# EAGLE design DMGC-IPS-01_1-3 (EAGLE 9.6.2)
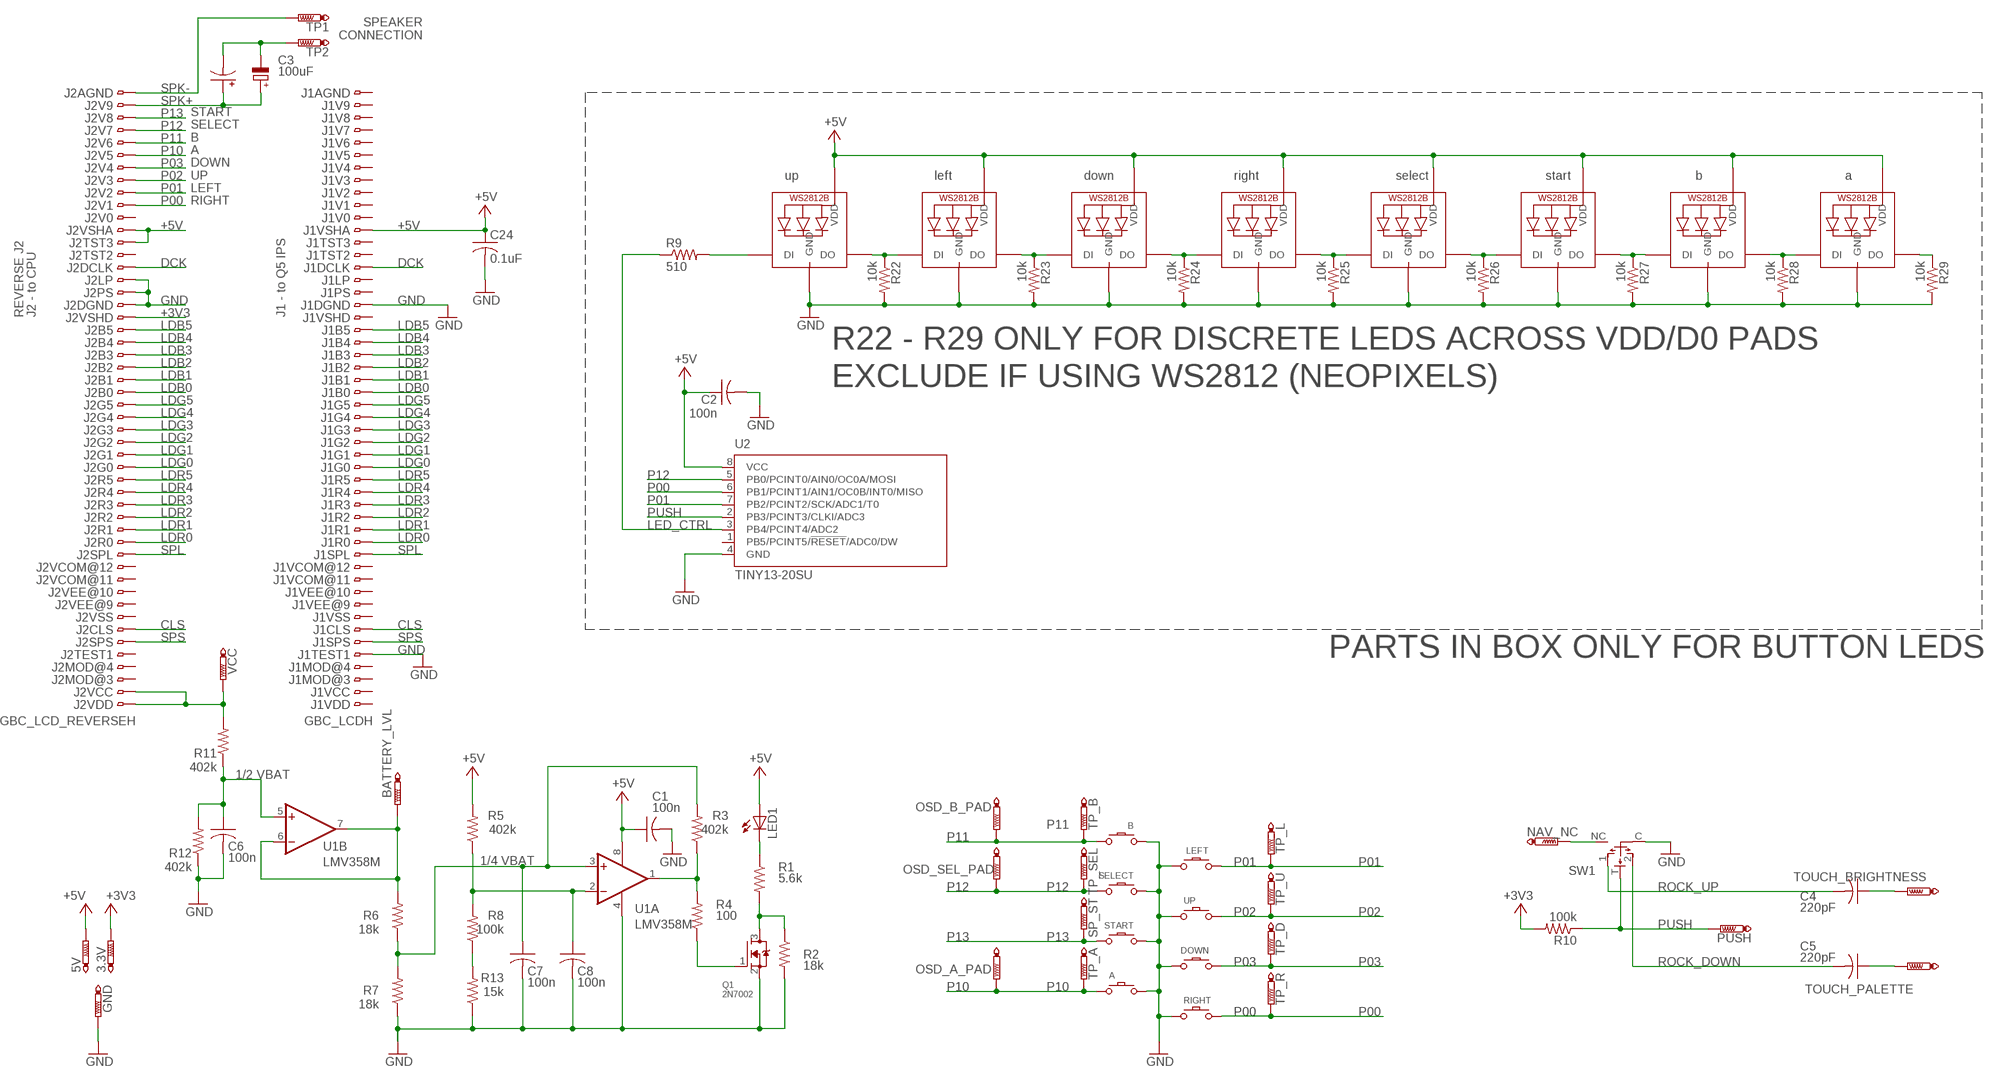
[diagram p0: schematic, sheet 1]

## Parts
3.3V  PTR1TP20R  [TP20R]
5V  PTR1TP20R  [TP20R]
A  DMG-BTN  DMG-BTNREGULAR  [DMG-BTN]
B  DMG-BTN  DMG-BTNREGULAR  [DMG-BTN]
BATTERY_LVL  PTR1TP20R  [TP20R]
C1  100n  C-USC0603  [C0603]
C2  100n  C-USC0603  [C0603]
C3  100uF  CPOL-USCT3528  [CT3528]
C3TH  CPOL-EUE2,5-6E  [E2,5-6E]
C4  220pF  C-USC0603  [C0603]
C5  220pF  C-USC0603  [C0603]
C6  100n  C-USC0603  [C0603]
C7  100n  C-USC0603  [C0603]
C8  100n  C-USC0603  [C0603]
C24  0.1uF  C-USC0603  [C0603]
DOWN  DMG-BTN  DMG-BTNREGULAR  [DMG-BTN]
GND  PTR1TP20R  [TP20R]
J1  GBC_LCDH  [FH12-50S-0.5SH]
J2  GBC_LCD_REVERSEH  [FH12-50S-0.5SH_REVERSE]
LED1  LED3MM  [LED3MM]
LED10  WS2812B3535  [LED3535]
LED11  WS2812B3535  [LED3535]
LED12  WS2812B3535  [LED3535]
LED13  WS2812B3535  [LED3535]
LED14  WS2812B3535  [LED3535]
LED15  WS2812B3535  [LED3535]
LED16  WS2812B3535  [LED3535]
LED17  WS2812B3535  [LED3535]
LEFT  DMG-BTN  DMG-BTNREGULAR  [DMG-BTN]
NAV_NC  PTR1TP20R  [TP20R]
OSD_A_PAD  PTR1TP20R  [TP20R]
OSD_B_PAD  PTR1TP20R  [TP20R]
OSD_SEL_PAD  PTR1TP20R  [TP20R]
PUSH  PTR1TP20R  [TP20R]
Q1  2N7002  MOSFET-NREFLOW  [SOT23]
R1  5.6k  R-US_R0603  [R0603]
R2  18k  R-US_R0603  [R0603]
R3  402k  R-US_R0603  [R0603]
R4  100  R-US_R0603  [R0603]
R5  402k  R-US_R0603  [R0603]
R6  18k  R-US_R0603  [R0603]
R7  18k  R-US_R0603  [R0603]
R8  100k  R-US_R0603  [R0603]
R9  510  R-US_R0603  [R0603]
R10  100k  R-US_R0603  [R0603]
R11  402k  R-US_R0603  [R0603]
R12  402k  R-US_R0603  [R0603]
R13  15k  R-US_R0603  [R0603]
R22  10k  R-US_R0603  [R0603]
R23  10k  R-US_R0603  [R0603]
R24  10k  R-US_R0603  [R0603]
R25  10k  R-US_R0603  [R0603]
R26  10k  R-US_R0603  [R0603]
R27  10k  R-US_R0603  [R0603]
R28  10k  R-US_R0603  [R0603]
R29  10k  R-US_R0603  [R0603]
RIGHT  DMG-BTN  DMG-BTNREGULAR  [DMG-BTN]
SELECT  DMG-BTN  DMG-BTNSTART  [DMG-ST]
SP_ST  PTR1TP20R  [TP20R]
START  DMG-BTN  DMG-BTNSTART  [DMG-ST]
SW1  NAV_SWITCH  [NAV_SWITCH]
TOUCH_BRIGHTNESS  PTR1TP20R  [TP20R]
TOUCH_PALETTE  PTR1TP20R  [TP20R]
TP1  PTR1PAD1-13  [P1-13]
TP2  PTR1PAD1-13  [P1-13]
TP_A  PTR1TP20R  [TP20R]
TP_B  PTR1TP20R  [TP20R]
TP_D  PTR1TP20R  [TP20R]
TP_L  PTR1TP20R  [TP20R]
TP_R  PTR1TP20R  [TP20R]
TP_SEL  PTR1TP20R  [TP20R]
TP_U  PTR1TP20R  [TP20R]
U1  LMV358M  [SO08]
U2  TINY13-20SU  [8S2]
UP  DMG-BTN  DMG-BTNREGULAR  [DMG-BTN]
VCC  PTR1TP20R  [TP20R]

## Nets
+3V3: 3.3V.TP J2.19 R10.2
+5V: 5V.TP C1.1 C2.1 C24.1 J1.39 J2.12 J2.13 LED1.A LED10.4(VDD) LED11.4(VDD) LED12.4(VDD) LED13.4(VDD) LED14.4(VDD) LED15.4(VDD) LED16.4(VDD) LED17.4(VDD) R5.2 U1.8(P:V+) U2.8(VCC)
BATT: J2.49 J2.50 R11.2 VCC.TP
CLS: J1.7 J2.44
DCK: J1.36 J2.15
GND: A.P$2 B.P$1 C1.2 C2.2 C6.2 C7.2 C8.2 C24.2 DOWN.P$2 GND.TP J1.5 J1.33 J2.16 J2.17 J2.18 LED10.2(GND) LED11.2(GND) LED12.2(GND) LED13.2(GND) LED14.2(GND) LED15.2(GND) LED16.2(GND) LED17.2(GND) LEFT.P$2 Q1.2(S) R2.2 R7.1 R12.1 R13.1 R22.2 R23.2 R24.2 R25.2 R26.2 R27.2 R28.2 R29.2 RIGHT.P$1 SELECT.P$1 START.P$1 SW1.C U1.4(P:V-) U2.4(GND) UP.P$1
LDB0: J1.26 J2.25
LDB1: J1.27 J2.24
LDB2: J1.28 J2.23
LDB3: J1.29 J2.22
LDB4: J1.30 J2.21
LDB5: J1.31 J2.20
LDG0: J1.20 J2.31
LDG1: J1.21 J2.30
LDG2: J1.22 J2.29
LDG3: J1.23 J2.28
LDG4: J1.24 J2.27
LDG5: J1.25 J2.26
LDR0: J1.14 J2.37
LDR1: J1.15 J2.36
LDR2: J1.16 J2.35
LDR3: J1.17 J2.34
LDR4: J1.18 J2.33
LDR5: J1.19 J2.32
LED_CTRL: R9.1 U2.3(PB4/PCINT4/ADC2)
N$1: Q1.3(D) R1.2 R2.1
N$2: LED1.K(C) R1.1
N$3: BATTERY_LVL.TP R6.2 U1.6(B:-IN) U1.7(B:OUT)
N$4: LED13.1(DO) LED16.3(DI) R27.1
N$5: LED15.3(DI) LED16.1(DO) R28.1
N$6: LED10.1(DO) LED14.3(DI) R22.1
N$7: C8.1 R5.1 R8.2 U1.2(A:-IN)
N$9: LED11.3(DI) LED14.1(DO) R23.1
N$10: LED11.1(DO) LED12.3(DI) R24.1
N$11: LED12.1(DO) LED17.3(DI) R25.1
N$12: LED13.3(DI) LED17.1(DO) R26.1
N$13: LED15.1(DO) R29.1
N$14: LED10.3(DI) R9.2
N$15: C6.1 R11.1 R12.2 U1.5(B:+IN)
N$16: NAV_NC.TP SW1.NC
N$17: C4.1 TOUCH_BRIGHTNESS.TP
N$18: C5.1 TOUCH_PALETTE.TP
N$19: C3.- C3TH.- TP2.TP
N$20: R8.1 R13.2
N$21: C7.1 R3.2 R6.1 R7.2 U1.3(A:+IN)
N$31: R3.1 R4.2 U1.1(A:OUT)
P00: J2.10 RIGHT.P$2 TP_R.TP U2.6(PB1/PCINT1/AIN1/OC0B/INT0/MISO)
P01: J2.9 LEFT.P$1 TP_L.TP U2.7(PB2/PCINT2/SCK/ADC1/T0)
P02: J2.8 TP_U.TP UP.P$2
P03: DOWN.P$1 J2.7 TP_D.TP
P10: A.P$1 J2.6 OSD_A_PAD.TP TP_A.TP
P11: B.P$2 J2.5 OSD_B_PAD.TP TP_B.TP
P12: J2.4 OSD_SEL_PAD.TP SELECT.P$2 TP_SEL.TP U2.5(PB0/PCINT0/AIN0/OC0A/MOSI)
P13: J2.3 SP_ST.TP START.P$2
PSU_EN: Q1.1(G) R4.1
PUSH: PUSH.TP R10.1 SW1.T U2.2(PB3/PCINT3/CLKI/ADC3)
ROCK_DOWN: C5.2 SW1.2
ROCK_UP: C4.2 SW1.1
SPK+: C3.+ C3TH.+ J2.2
SPK-: J2.1 TP1.TP
SPL: J1.13 J2.38
SPS: J1.6 J2.45
Unconnected: J1.1 J1.2 J1.3 J1.4 J1.8 J1.9 J1.10 J1.11 J1.12 J1.32 J1.34 J1.35 J1.37 J1.38 J1.40 J1.41 J1.42 J1.43 J1.44 J1.45 J1.46 J1.47 J1.48 J1.49 J1.50 J2.11 J2.14 J2.39 J2.40 J2.41 J2.42 J2.43 J2.46 J2.47 J2.48 U2.1(PB5/PCINT5/!RESET!/ADC0/DW)

## Notes on the sheet
- SPEAKER
  CONNECTION
- up | left | down | right | select | start | b | a
- START
  SELECT
  B
  A
  DOWN
  UP
  LEFT
  RIGHT
- REVERSE J2 | J2 - to CPU | J1 - to Q5 IPS
- R22 - R29 ONLY FOR DISCRETE LEDS ACROSS VDD/D0 PADS
- EXCLUDE IF USING WS2812 (NEOPIXELS)
- PARTS IN BOX ONLY FOR BUTTON LEDS
- 1/2 VBAT
- 1/4 VBAT

## Library data of the parts
3.3V 5V BATTERY_LVL GND NAV_NC OSD_A_PAD OSD_B_PAD OSD_SEL_PAD PUSH SP_ST TOUCH_BRIGHTNESS TOUCH_PALETTE TP1 TP2 TP_A TP_B TP_D TP_L TP_R TP_SEL TP_U VCC = testpad:PTR1: TEST PIN
A B DOWN LEFT RIGHT SELECT START UP = Game Boy:DMG-BTN
C1 C2 C4-C8 C24 = rcl:C-US: CAPACITOR, American symbol; SPICEPREFIX: C
C3 = rcl:CPOL-US: POLARIZED CAPACITOR, American symbol; SPICEPREFIX: C
C3TH = rcl:CPOL-EU: POLARIZED CAPACITOR, European symbol; SPICEPREFIX: C
J1 = gameboy:GBC_LCD: 0.5mm Pitch Connectors For FPC/FFC Source: Data sheet <http://www.hirose.co.jp/cataloge_hp/e58605370.pdf>; MPN: FH12-50S-0.5SH(55); OC_FARNELL: 1324557; OC_NEWARK: 34M6181
J2 = gameboy:GBC_LCD_REVERSE: 0.5mm Pitch Connectors For FPC/FFC Source: Data sheet <http://www.hirose.co.jp/cataloge_hp/e58605370.pdf>
LED1 = led:LED: LED OSRAM: - CHIPLED LG R971, LG N971, LY N971, LG Q971, LY Q971, LO R971, LY R971 LH N974, LH R974 LS Q976, LO Q976, LY Q976 LO Q996 - Hyper CHIPLED LW Q18S LB Q993, LB Q99A, LB R99A - SideLED LS A670, LO A670, LY A670, LG A670, LP A670 LB A673, LV A673, LT A673, LW A673 LH A674 LY A675 LS A676, LA A676, LO A676, LY A676, LW A676 LS A679, LY A679, LG A679 - Hyper Micro SIDELED® LS Y876, LA Y876, LO Y876, LY Y876 LT Y87S - SmartLED LW L88C, LW L88S LB L89C, LB L89S, LG L890 LS L89K, LO L89K, LY L89K LS L896, LA L896, LO L896, LY L896 - TOPLED LS T670, LO T670, LY T670, LG T670, LP T670 LSG T670, LSP T670, LSY T670, LOP T670, LYG T670 LG T671, LOG T671, LSG T671 LB T673, LV T673, LT T673, LW T673 LH T674 LS T676, LA T676, LO T676, LY T676, LB T676, LH T676, LSB T676, LW T676 LB T67C, LV T67C, LT T67C, LS T67K, LO T67K, LY T67K, LW E67C LS E67B, LA E67B, LO E67B, LY E67B, LB E67C, LV E67C, LT E67C LW T67C LS T679, LY T679, LG T679 LS T770, LO T770, LY T770, LG T770, LP T770 LB T773, LV T773, LT T773, LW T773 LH T774 LS E675, LA E675, LY E675, LS T675 LS T776, LA T776, LO T776, LY T776, LB T776 LHGB T686 LT T68C, LB T68C - Hyper Mini TOPLED® LB M676 - Mini TOPLED Santana® LG M470 LS M47K, LO M47K, LY M47K Source: http://www.osram.convergy.de LUXEON: - LUMILED® LXK2-PW12-R00, LXK2-PW12-S00, LXK2-PW14-U00, LXK2-PW14-V00 LXK2-PM12-R00, LXK2-PM12-S00, LXK2-PM14-U00 LXK2-PE12-Q00, LXK2-PE12-R00, LXK2-PE12-S00, LXK2-PE14-T00, LXK2-PE14-U00 LXK2-PB12-K00, LXK2-PB12-L00, LXK2-PB12-M00, LXK2-PB14-N00, LXK2-PB14-P00, LXK2-PB14-Q00 LXK2-PR12-L00, LXK2-PR12-M00, LXK2-PR14-Q00, LXK2-PR14-R00 LXK2-PD12-Q00, LXK2-PD12-R00, LXK2-PD12-S00 LXK2-PH12-R00, LXK2-PH12-S00 LXK2-PL12-P00, LXK2-PL12-Q00, LXK2-PL12-R00 Source: www.luxeon.com KINGBRIGHT: KA-3528ASYC Source: www.kingbright.com
LED10-LED17 = adafruit:WS2812B
Q1 = adafruit:MOSFET-N: N-Channel Mosfet 2N7002E - 60V 260mA SOT23 [Digikey: 2N7002ET1GOSTR-ND] - REEL BSH103 - 30V 850mA SOT23 [Digikey: 568-5013-1-ND]
R1-R13 R22-R29 = rcl:R-US_: RESISTOR, American symbol; SPICEPREFIX: R
SW1 = gameboy:NAV_SWITCH: TINY SWITCH ON OFF MOM Source: http://www2.produktinfo.conrad.com/datenblaetter/700000-724999/705152-da-01-de-Subminiaturschalter_TL_36YO.pdf
U1 = linear:LMV358?*: Dual General Purpose, Low Voltage, Rail-to-Rail Output Operational Amplifiers Source: http://www.national.com/mpf/LM/LMV321.html http://www.national.com/dt/lmv_qual.pdf
U2 = atmel:TINY13: 8-bit AVR Microcontroller with 1K Bytes In-System Programmable Flash Source: http://www.atmel.com/dyn/resources/prod_documents/2535S.pdf; MPN: ATTINY13-20SU; OC_FARNELL: 9171568; OC_NEWARK: 96K6522

## Board
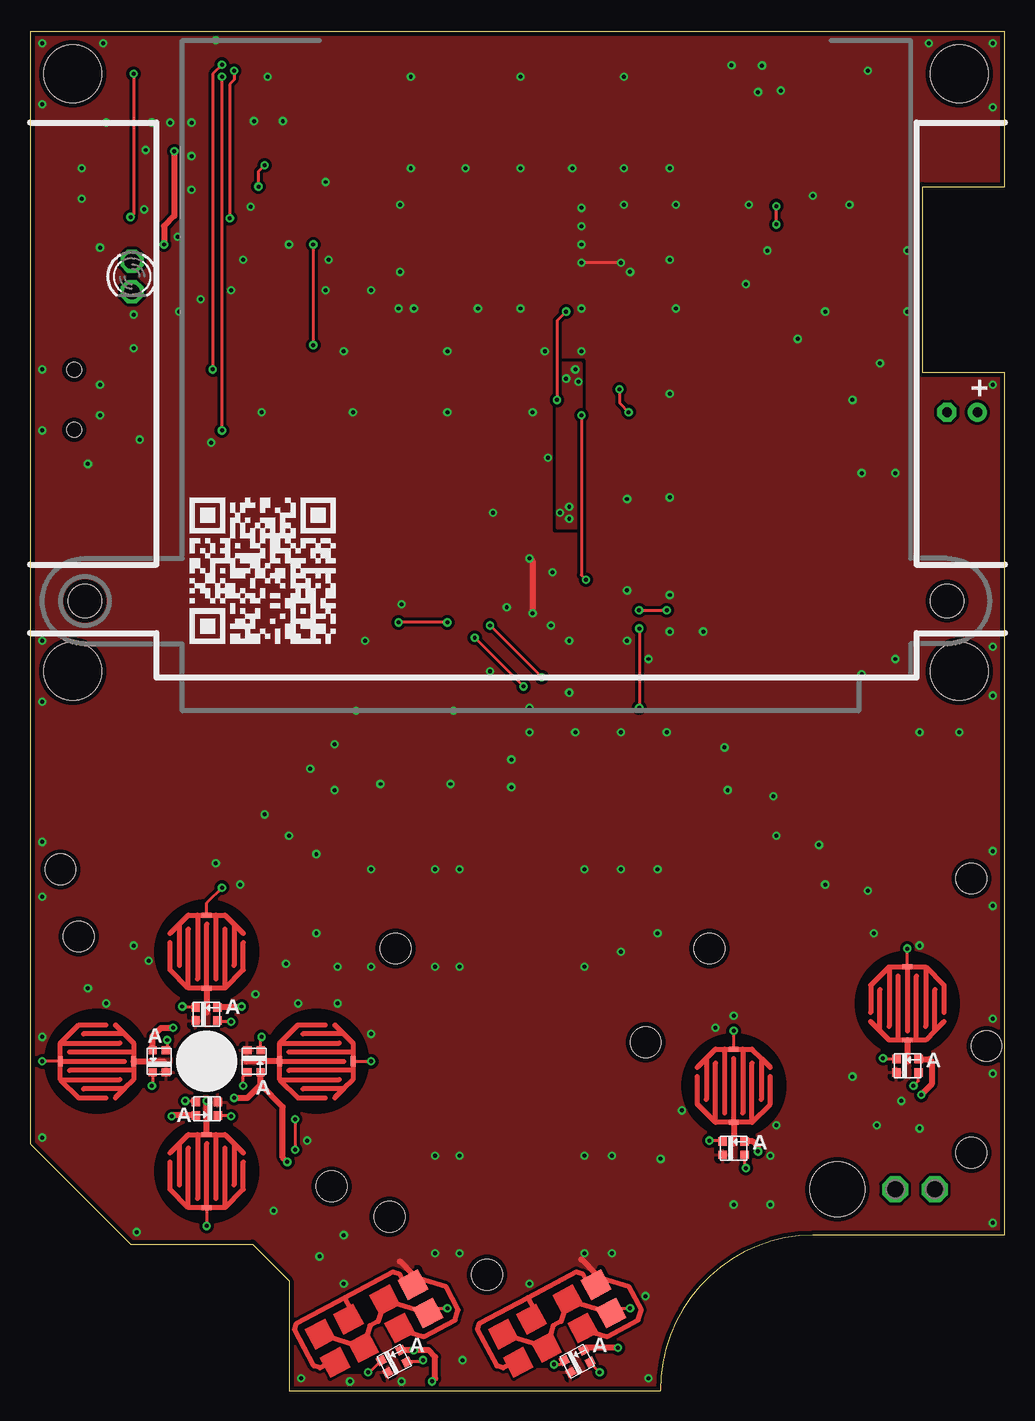
[diagram p1: board, top side]
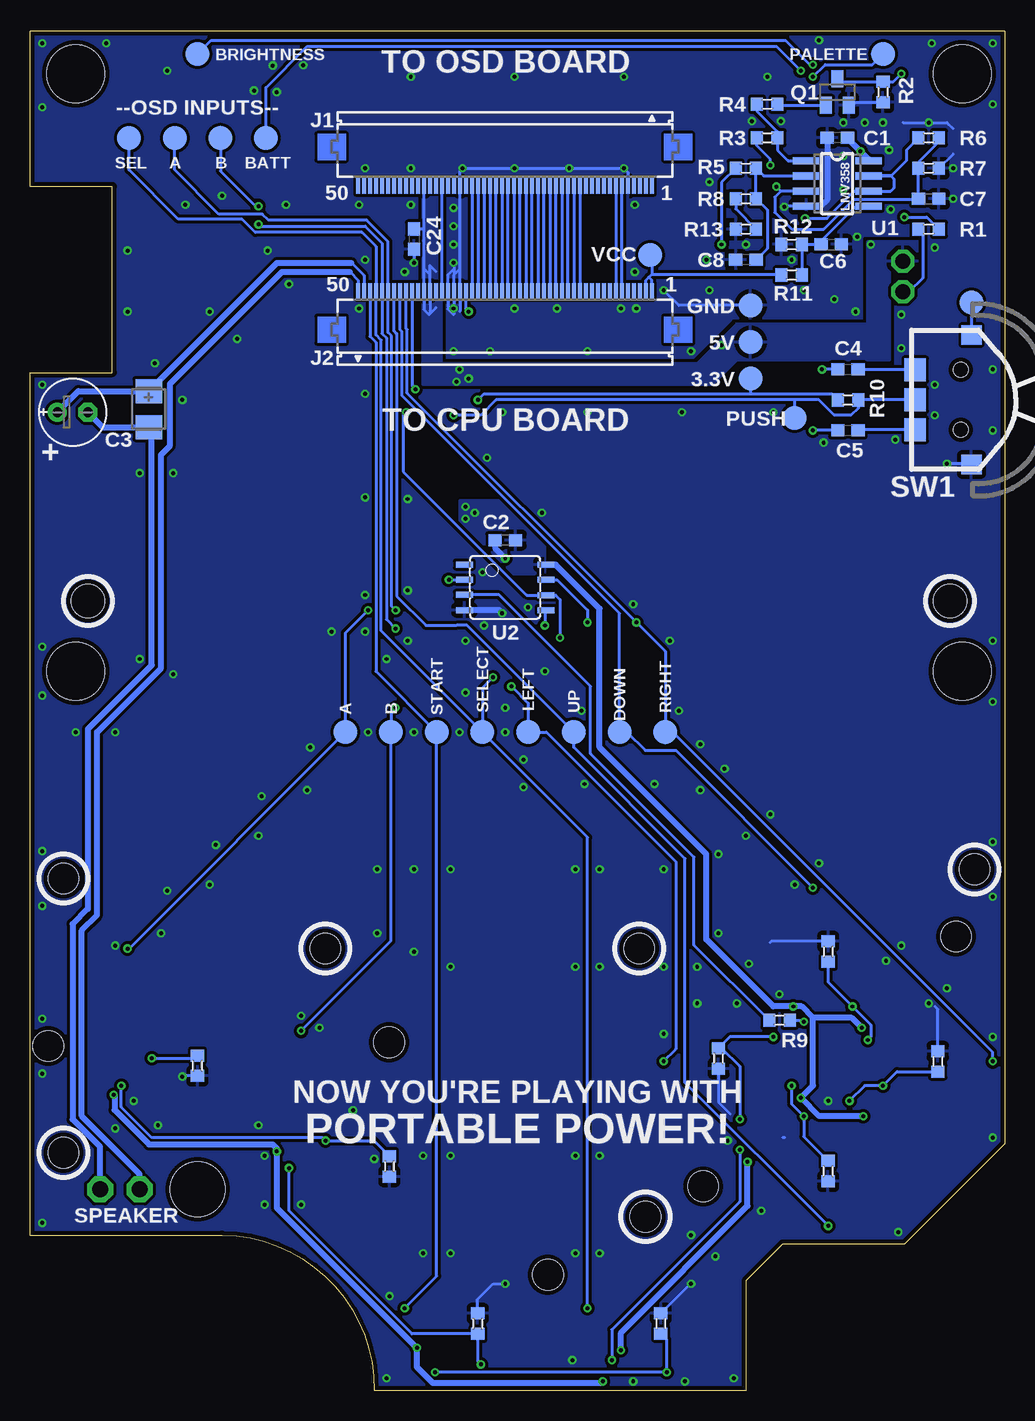
[diagram p2: board, bottom side, seen from below]

Size 81.28 x 113.28 mm. Coordinates in mm from the lower left corner, seen from the top.
Outline: 0,20.57 8.38,12.19 18.54,12.19 21.59,9.14 21.59,0 52.58,0 arc-90 65.28,12.95 81.28,12.95 81.28,84.84 74.42,84.84 74.42,100.33 81.28,100.33 81.28,113.28 0,113.28 0,20.57
Copper layers (1*16): Top 0.0356mm / dielectric 1.5011mm / Bottom 0.0356mm
Design rules "jlcpcb *": minimum track width 8mil, minimum drill 13mil, track to track 7mil, track to pad 7mil, pad to pad 7mil, via to via 7mil, smd to smd 5mil, copper to edge 15mil, drill to drill 22mil, minimum pad ring 7mil, minimum via ring 7mil, stop-mask expansion 2.5mil, vias tented up to drill 13mil, thermal gap 15mil
Holes 4.83 mm at 3.56,59.94 77.47,59.94 3.56,109.73 77.47,109.73
Holes 4.57 mm at 67.31,16.76
Holes 2.79 mm at 76.45,65.79 4.57,65.79
Holes 2.54 mm at 2.54,43.43 78.49,42.67 78.49,19.81 30.48,36.83 56.64,36.83 29.97,14.48 25.15,17.02 38.1,9.65 79.76,28.7 4.06,37.85 51.34,29.02
tRestrict: area 26.2,1.8 to 27.7,2.5; area 41.7,2.3 to 43.2,2.8
bRestrict: area 45.2,91.4 to 48.5,91.9; area 47.2,92.2 to 47.5,92.5

### Footprints (pad centres in the part's own frame; a part is rotated, then mirrored left to right if it is on the bottom)
TP20R = smd 2 x 2: TP 0,0
DMG-BTN = smd 0.813 x 0.406: P$1 0,-3.048; P$2 0,3.048
C0603 = smd 1.1 x 1: 1 -0.85,0; 2 0.85,0
CT3528 = smd 2 x 2.2: + -1.5,0; - 1.5,0
E2,5-6E = drill 0.813 pad 1.575: + -1.27,0 | drill 0.813 pad 1.575 octagon: - 1.27,0
FH12-50S-0.5SH = smd 0.3 x 1.3: 1 -12.25,3.25; 2 -11.75,3.25; 3 -11.25,3.25; 4 -10.75,3.25; 5 -10.25,3.25; 6 -9.75,3.25; 7 -9.25,3.25; 8 -8.75,3.25; 9 -8.25,3.25; 10 -7.75,3.25; 11 -7.25,3.25; 12 -6.75,3.25; 13 -6.25,3.25; 14 -5.75,3.25; 15 -5.25,3.25; 16 -4.75,3.25; 17 -4.25,3.25; 18 -3.75,3.25; 19 -3.25,3.25; 20 -2.75,3.25; 21 -2.25,3.25; 22 -1.75,3.25; 23 -1.25,3.25; 24 -0.75,3.25; 25 -0.25,3.25; 26 0.25,3.25; 27 0.75,3.25; 28 1.25,3.25; 29 1.75,3.25; 30 2.25,3.25; 31 2.75,3.25; 32 3.25,3.25; 33 3.75,3.25; 34 4.25,3.25; 35 4.75,3.25; 36 5.25,3.25; 37 5.75,3.25; 38 6.25,3.25; 39 6.75,3.25; 40 7.25,3.25; 41 7.75,3.25; 42 8.25,3.25; 43 8.75,3.25; 44 9.25,3.25; 45 9.75,3.25; 46 10.25,3.25; 47 10.75,3.25; 48 11.25,3.25; 49 11.75,3.25; 50 12.25,3.25
FH12-50S-0.5SH_REVERSE = smd 0.3 x 1.3: 1 -12.25,3.25; 2 -11.75,3.25; 3 -11.25,3.25; 4 -10.75,3.25; 5 -10.25,3.25; 6 -9.75,3.25; 7 -9.25,3.25; 8 -8.75,3.25; 9 -8.25,3.25; 10 -7.75,3.25; 11 -7.25,3.25; 12 -6.75,3.25; 13 -6.25,3.25; 14 -5.75,3.25; 15 -5.25,3.25; 16 -4.75,3.25; 17 -4.25,3.25; 18 -3.75,3.25; 19 -3.25,3.25; 20 -2.75,3.25; 21 -2.25,3.25; 22 -1.75,3.25; 23 -1.25,3.25; 24 -0.75,3.25; 25 -0.25,3.25; 26 0.25,3.25; 27 0.75,3.25; 28 1.25,3.25; 29 1.75,3.25; 30 2.25,3.25; 31 2.75,3.25; 32 3.25,3.25; 33 3.75,3.25; 34 4.25,3.25; 35 4.75,3.25; 36 5.25,3.25; 37 5.75,3.25; 38 6.25,3.25; 39 6.75,3.25; 40 7.25,3.25; 41 7.75,3.25; 42 8.25,3.25; 43 8.75,3.25; 44 9.25,3.25; 45 9.75,3.25; 46 10.25,3.25; 47 10.75,3.25; 48 11.25,3.25; 49 11.75,3.25; 50 12.25,3.25
LED3MM = drill 1.27 octagon: A -1.27,0; K 1.27,0
LED3535 = smd 0.7 x 0.7: 1 -0.915,0.555; 2 -0.915,-0.555; 3 0.915,-0.555; 4 0.915,0.555
SOT23 = smd 1 x 1.4: 1 -0.95,-1.1; 2 0.95,-1.1; 3 0,1.1
R0603 = smd 1 x 1.1: 1 -0.85,0; 2 0.85,0
DMG-ST = smd 1.905 x 1.905: P$1 4.381,1.333; P$2 4.381,-1.333
NAV_SWITCH = smd 1.9 x 1.8: 1 -2.5,-3.8; 2 2.5,-3.8; T 0,-3.8 | smd 1.6 x 1.7: C 5.4,0.9; NC -5.4,0.9 | hole 1.25: -2.5,0; 2.5,0
P1-13 = drill 1.321 pad 2.159 octagon: TP 0,0
SO08 = smd 0.6 x 2.2: 1 -1.905,-2.6; 2 -0.635,-2.6; 3 0.635,-2.6; 4 1.905,-2.6; 5 1.905,2.6; 6 0.635,2.6; 7 -0.635,2.6; 8 -1.905,2.6
8S2 = smd 0.5 x 1.4: 1 -1.905,-3.404; 2 -0.645,-3.404; 3 0.625,-3.404; 4 1.895,-3.404; 5 1.905,3.404; 6 0.635,3.404; 7 -0.635,3.404; 8 -1.905,3.404

### Placement (x,y rotation side)
3.3V  21.21,84.33 0 bottom
5V  21.21,87.38 0 bottom
A  73.15,32.26 180 top
B  58.67,25.4 0 top
BATTERY_LVL  61.59,104.39 0 bottom
C1  13.97,104.39 180 bottom
C2  41.66,70.87 180 bottom
C3  71.37,81.79 270 bottom
C3TH  77.72,81.53 0 bottom
C4  13.08,85.09 0 bottom
C5  13.08,80.01 0 bottom
C6  14.48,95.5 0 bottom
C7  6.35,99.31 0 bottom
C8  21.59,94.23 180 bottom
C24  49.28,95.95 270 bottom
DOWN  14.73,18.29 0 top
GND  21.21,90.42 0 bottom
J1  41.68,103.63 180 bottom
J2  41.68,88.39 0 bottom
LED1  8.51,92.84 270 top
LED10  14.72,31.38 0 top
LED11  14.74,23.49 180 top
LED12  18.68,27.44 270 top
LED13  45.62,2.44 28 top
LED14  10.78,27.44 90 top
LED15  73.15,27.06 0 top
LED16  58.67,20.21 0 top
LED17  30.36,2.44 28 top
LEFT  5.59,27.43 270 top
NAV_NC  2.79,90.68 0 bottom
OSD_A_PAD  69.22,104.39 0 bottom
OSD_B_PAD  65.41,104.39 0 bottom
OSD_SEL_PAD  73.03,104.39 0 bottom
PUSH  17.53,81.03 0 bottom
Q1  13.97,108.2 0 bottom
R1  6.35,96.77 0 bottom
R2  10.16,108.2 270 bottom
R3  19.81,104.39 180 bottom
R4  19.81,107.19 180 bottom
R5  21.59,101.85 180 bottom
R6  6.35,104.39 180 bottom
R7  6.35,101.85 180 bottom
R8  21.59,99.31 0 bottom
R9  18.8,30.86 0 bottom
R10  13.08,82.55 180 bottom
R11  17.78,92.96 180 bottom
R12  17.78,95.5 0 bottom
R13  21.59,96.77 0 bottom
R22  14.73,36.58 90 bottom
R23  5.59,27.42 90 bottom
R24  14.74,18.29 270 bottom
R25  23.87,27.69 270 bottom
R26  28.69,5.59 90 bottom
R27  43.95,5.58 90 bottom
R28  51.31,18.68 270 bottom
R29  67.32,27.06 270 bottom
RIGHT  23.88,27.43 270 top
SELECT  28.69,5.58 28 top
SP_ST  47.37,54.86 0 bottom
START  43.95,5.58 28 top
SW1  3.68,82.57 270 bottom
TOUCH_BRIGHTNESS  67.31,111.38 0 bottom
TOUCH_PALETTE  10.16,111.38 0 bottom
TP1  72.14,16.76 0 top
TP2  75.44,16.76 0 top
TP_A  54.99,54.86 0 bottom
TP_B  51.18,54.86 0 bottom
TP_D  35.94,54.86 0 bottom
TP_L  28.32,54.86 0 bottom
TP_R  39.75,54.86 0 bottom
TP_SEL  43.56,54.86 0 bottom
TP_U  32.13,54.86 0 bottom
U1  13.97,100.58 270 bottom
U2  41.66,66.93 270 bottom
UP  14.73,36.58 0 top
VCC  29.59,94.62 0 bottom

### Tracks (layer width: path | path; a pad name or v marks a point on that pad's centre or on a via)
+3V3  (via drill 0.33)
  Top 0.254: v44.7,89.92 43.94,89.15 v43.94,82.55
  Bottom 0.254: v43.94,82.55 43.43,83.06 21.21,83.06 | 21.21,83.06 14.44,83.06 R10.2 | v44.7,89.92 44.93,90.14 J2.19 | 3.3V.TP 21.21,83.06
+5V  (via drill 0.33)
  Top 0.254: v23.62,95.5 v23.62,87.12
  Top 0.508: v12.04,103.28 12.04,97.89 11.18,97.03 v11.18,95.5 | LED15.4 75,27.62 75.18,27.43 75.18,25.51 v74.31,24.64 | v60.71,19.93 60.71,20.31 60.25,20.76 LED16.4 | v49.02,3.56 46.36,3.56 LED13.4 | v33.53,0.76 33.78,1.02 33.78,2.79 33.22,3.36 v32,3.36 LED17.4 | v21.45,19.05 21.08,19.42 21.08,23.62 19.23,25.47 | 19.23,25.47 LED12.4 | LED11.4 11.88,22.93 v11.81,22.86 | v17.02,24.38 18.14,24.38 19.23,25.47 | v17.65,32 17.58,31.93 LED10.4 | LED14.4 10.23,29.53 10.92,30.23 v11.94,30.23
  Bottom 0.254: 48.43,93.47 J2.12 48.43,90.09 48.01,89.66 47.93,89.74 | 48.43,93.47 48.43,96.77 | 48.43,96.77 J1.39 | 47.93,92.97 J2.13 47.93,89.74 | 47.93,92.97 47.93,93.73 47.43,93.23 | 47.93,92.97 48.43,93.47 | C24.1 48.45,96.8 48.43,96.77 | 11.37,102.62 U1.8 | 47.43,90.24 47.93,89.74 | R5.2 23.62,100.67 v23.62,95.5
  Bottom 0.508: C1.1 13.12,104.37 v12.04,103.28 11.37,102.62 | v74.31,24.64 74.22,24.55 74.22,23.39 71.35,20.52 61.05,20.52 60.71,20.18 v60.71,19.93 60.71,15.21 49.05,3.56 | 49.05,3.56 v49.02,3.56 | 49.05,3.56 49.03,3.54 49.03,1.97 47.7,0.63 33.66,0.63 v33.53,0.76 | v32,3.36 32,4.83 21.45,15.38 v21.45,19.05 | v11.81,22.86 15.49,22.86 v17.02,24.38 15.99,25.41 15.99,31.05 | 15.99,31.05 16.94,32 v17.65,32 19.3,32 24.89,37.59 24.89,44.7 33.78,53.59 33.78,65.15 37.47,68.83 U2.8 | v11.94,30.23 12.77,31.05 15.99,31.05
  other vias: 44.96,72.64 44.96,73.66 44.2,73.15 44.7,84.33 45.47,85.09 45.72,84.07
  pour Bottom: 46.99,100.58 46.99,83.82 48.51,83.82 48.51,100.58
  pour Bottom (isolate 0.254): 6.86,95.76 6.86,93.47 9.65,93.47 9.65,85.85 22.35,85.85 24.38,83.82 48.51,83.82 48.51,85.6 25.65,85.6 22.35,88.9 11.43,88.9 11.43,95.76
  pour Top (isolate 0.254): 43.94,85.6 43.94,71.88 45.97,71.88 45.97,85.6
  pour Bottom (isolate 0.254): 38.35,68.07 38.35,70.61 41.91,74.17 45.47,74.17 45.47,71.88 41.66,68.07
BATT
  Bottom 0.254: R11.2 29.49,92.96 | 29.49,92.96 29.68,92.78 | VCC.TP 29.42,94.62 29.42,93.03 29.49,92.96 | J2.49 29.93,92.52 29.68,92.78 | J2.50 29.43,92.53 29.68,92.78
CLS
  Bottom 0.254: J1.7 J2.44
DCK
  Bottom 0.254: J2.15 J1.36
GND  (via drill 0.33)
  Top 0.254: v49.28,93.98 v45.97,93.98
  Top 0.508: v41.66,69.34 41.91,69.09 v41.91,64.77 | SELECT.P$1 31.93,9.66 30.84,10.76 | START.P$1 47.2,9.7 45.97,10.92 | DOWN.P$2 14.73,23.88 | LEFT.P$2 11.18,27.43 | RIGHT.P$1 18.03,27.43 | UP.P$1 14.73,31.5 | B.P$1 58.67,20.57 | A.P$2 73.15,27.43
  Bottom 0.254: 45.43,93.47 J2.18 45.43,89.95 45.47,89.92 | 45.43,93.47 J1.33 45.43,101.64 v45.21,101.85 v31.75,101.85 31.43,101.53 J1.5 | 45.93,92.97 J2.17 45.93,89.71 45.97,89.66 46.43,90.12 J2.16 46.43,92.98 45.93,93.48 | 45.93,92.97 45.43,93.47 | 16.26,98.68 U1.4 18.38,98.68 v18.4,98.65 | R2.2 12.7,107.35 12.95,107.1 Q1.2 | 8.47,105.66 4.83,105.66 4.32,105.16 | 4.32,103.04 R7.1 | SW1.C 2.83,77.22 v4.83,77.22 | C24.2 v49.28,93.98 | v45.97,93.98 45.93,93.94 45.93,93.48 | 45.93,93.48 45.93,92.97 | R26.2 26.24,8.89 v26.16,8.89 | R27.2 43.95,7.61 42.67,8.89 v41.66,8.89 | 18.38,21.08 18.54,21.08 | R23.2 5.59,31.75 5.84,32 | R25.2 23.87,24.03 22.89,23.04 | v52.58,19.3 52.58,19.09 | R29.2 68.53,26.21 v68.58,26.16 | R22.2 19.47,37.43 19.56,37.34 | v28.45,91.69 27.18,90.42 GND.TP
  Bottom 0.508: C2.2 42.51,70.19 v41.66,69.34 | v41.91,64.77 42.17,65.03 U2.4 | C1.2 14.82,99.23 15.37,98.68 16.26,98.68
  other vias: 4.32,99.31 21.59,95.5 30.99,0.76 26.67,0.76 14.73,24.13 25.65,35.31 25.65,32.26 22.35,32.26 1.02,112.27 80.26,112.27 80.26,13.97 51.56,1.02 22.61,1.02 8.89,13.21 1.02,21.08 80.26,83.82 6.35,32.26 9.91,35.81 8.64,37.08 4.83,33.53 17.53,42.16 21.59,46.23 25.4,50.04 15.49,43.94 19.56,48.01 23.37,51.82 25.4,53.85 29.21,50.55 23.88,44.7 23.88,38.1 21.34,35.56 18.8,33.02 28.45,43.43 28.45,35.31 28.45,29.72 23.11,20.83 26.16,12.95 24.13,11.18 20.32,14.99 35.05,50.55 43.43,63.75 35.31,56.64 38.35,59.94 41.66,56.9 44.96,58.17 51.56,60.96 45.47,54.86 40.13,52.58 33.78,43.43 33.78,35.31 33.78,19.56 33.78,11.43 53.34,63.25 53.09,54.86 49.28,54.86 41.66,54.86 46.23,43.43 49.28,43.43 35.81,43.43 40.13,50.29 35.81,35.31 46.23,35.31 35.81,19.56 46.23,19.56 46.23,11.43 35.81,11.43 36.07,2.54 48.51,11.43 48.51,19.56 49.28,36.58 57.15,30.23 54.36,23.34 58.67,15.49 51.31,7.87 61.72,15.49 61.72,19.56 74.17,21.84 72.64,24.13 70.61,22.1 62.23,22.1 58.67,31.24 52.32,38.1 52.32,43.43 58.17,50.04 62.23,46.23 66.29,42.16 70.36,38.1 74.17,37.08 69.85,41.66 65.79,45.47 61.98,49.53 57.91,53.59 56.13,63.25 53.34,66.29 44.96,62.48 49.78,62.48 80.26,40.39 80.26,44.96 80.26,57.91 80.26,61.98 74.93,112.27 80.26,106.93 15.49,112.52 6.1,112.27 1.02,107.19 1.02,85.09 1.02,80.01 1.02,62.48 1.02,57.4 1.02,45.72 1.02,41.15 1.02,29.46 53.34,83.06 53.34,74.42 53.85,90.17 59.69,92.2 68.58,82.55 69.34,76.45 69.34,59.69 74.17,54.86 77.47,54.86 80.26,26.42 72.14,76.45 70.87,85.6 61.47,95 53.34,94.23 50.04,93.22 45.97,95.5 45.97,97.03 45.97,98.55 40.89,101.85 36.32,101.85 30.86,98.81 24.89,94.23 24.64,100.71 11.68,105.66 13.46,100.08 13.46,102.87 12.45,89.92 12.32,96.14 26.16,86.61 45.97,86.61 45.97,90.17 30.73,90.17 32,90.17 42.93,86.61 41.91,81.53 34.8,81.53 26.92,81.53 19.3,81.53 9.14,79.25 5.84,81.28 5.84,83.82 8.64,86.87 8.64,89.66 5.84,95.25 4.32,101.85 6.35,105.66 9.65,103.38 10.16,105.66 13.46,105.66 18.67,105.79 19.81,109.47 61.04,110.41 69.85,109.98 49.53,101.85 53.34,101.85 49.53,98.81 53.85,98.81 59.94,98.81 65.28,99.57 68.33,98.81 31.75,109.47 40.89,109.47 49.53,109.47 17.78,94.23 34.8,86.61 37.34,90.17 40.89,90.17 43.18,77.72 38.61,73.15 30.99,65.53 27.94,62.48 27.18,56.64 66.29,89.92 64.01,87.63 73.15,89.92 73.15,95 72.14,60.96 49.78,66.67 39.75,65.28 43.56,68.2 58.5,110.44 62.61,108.33 60.71,108.2 80.26,30.99 24.64,91.69 16.76,91.69 14.22,90.93 9.53,98.42 21.08,105.79 30.86,93.22 15.11,78.99 49.78,74.3
  pour Top (isolate 0.254, rank 6): -4.83,116.33 84.07,116.33 85.34,115.06 85.34,11.94 63.5,-9.91 8.89,-9.91 -10.16,9.14 -10.16,111
  pour Bottom (isolate 0.254, rank 6): -3.3,116.08 -0.25,119.13 89.66,119.13 89.66,6.35 94.49,1.52 83.06,-9.91 29.97,-9.91 -9.65,29.72 -9.65,39.37 -9.65,109.73
LDB0
  Bottom 0.254: J1.26 J2.25
LDB1
  Bottom 0.254: J2.24 J1.27
LDB2
  Bottom 0.254: J1.28 J2.23
LDB3
  Bottom 0.254: J1.29 J2.22
LDB4
  Bottom 0.254: J1.30 J2.21
LDB5
  Bottom 0.254: J1.31 J2.20
LDG0
  Bottom 0.254: J1.20 J2.31
LDG1
  Bottom 0.254: J2.30 J1.21
LDG2
  Bottom 0.254: J1.22 J2.29
LDG3
  Bottom 0.254: J2.28 J1.23
LDG4
  Bottom 0.254: J1.24 J2.27
LDG5
  Bottom 0.254: J2.26 J1.25
LDR0
  Bottom 0.254: J1.14 J2.37
LDR1
  Bottom 0.254: J2.36 J1.15
LDR2
  Bottom 0.254: J1.16 J2.35
LDR3
  Bottom 0.254: J2.34 J1.17
LDR4
  Bottom 0.254: J1.18 J2.33
LDR5
  Bottom 0.254: J2.32 J1.19
LED_CTRL
  Bottom 0.254: R9.1 25.91,37.12 25.91,44.45 34.54,53.09 34.54,58.67 42.17,66.3 U2.3
N$1  (via drill 0.33)
  Top 0.254: v8.64,109.73 8.64,98.04 v8.38,97.79
  Bottom 0.254: v8.64,109.73 9.31,109.05 R2.1 13.46,109.05 13.72,109.05 Q1.3 | v8.38,97.79 6.52,97.79 R1.2
N$2
  Bottom 0.254: R1.1 6.86,96.43 6.86,92.71 8,91.57 LED1.K
N$3  (via drill 0.33)
  Top 0.254: v17.02,109.98 17.02,109.22 16.65,108.85 16.65,97.7 v16.66,97.69
  Bottom 0.254: R6.2 8.22,103.38 8.22,102.49 9.49,101.22 U1.7 9.53,101.22 9.27,100.97 9.27,100.2 9.53,99.95 U1.6 12.57,99.95 14.84,97.69 v16.66,97.69 | BATTERY_LVL.TP 61.59,108.59 58.17,112.01 19.05,112.01 v17.02,109.98
N$4  (via drill 0.33)
  Top 0.254: v43.69,2.17 44.22,2.17 LED13.1 | v59.69,18.54 59.59,18.64 LED16.3
  Bottom 0.254: v43.69,2.17 43.95,2.44 R27.1 49.43,4.73 59.69,14.99 v59.69,18.54
N$5  (via drill 0.33)
  Top 0.254: LED16.1 57.69,20.83 v56.64,20.83 | v73.66,25.4 74.07,25.81 LED15.3
  Bottom 0.254: R28.1 52.61,20.83 v56.64,20.83 56.9,21.08 71.12,21.08 73.66,23.62 v73.66,25.4
N$6  (via drill 0.33)
  Top 0.254: LED10.1 12.77,31.93 v12.7,32 | v11.43,29.21 11.43,28.45 LED14.3
  Bottom 0.254: R22.1 14.73,34.04 v12.7,32 11.18,30.48 11.18,29.46 v11.43,29.21
N$7
  Bottom 0.254: U1.2 20.11,101.22 R5.1 R8.2 19.81,98.39 19.81,95.16 C8.1
N$9  (via drill 0.33)
  Top 0.254: LED14.1 10.23,25.47 v10.16,25.4 | v12.95,24.13 13.73,24.13 LED11.3
  Bottom 0.254: R23.1 8.99,26.57 v10.16,25.4 11.68,25.4 v12.95,24.13
N$10  (via drill 0.33)
  Top 0.254: LED11.1 16.69,22.93 v16.76,22.86 | v17.78,25.4 17.78,26.18 LED12.3
  Bottom 0.254: R24.1 16.76,21.16 v16.76,22.86 17.78,23.88 v17.78,25.4
N$11  (via drill 0.33)
  Top 0.254: LED12.1 19.23,29.39 v19.3,29.46 | v22.1,22.61 v22.1,20.07 | v32.77,2.54 32.61,2.38 LED17.3
  Bottom 0.254: v19.3,29.46 22.95,29.46 R25.1 23.62,28.54 22.1,27.02 v22.1,22.61 | v22.1,20.07 22.1,15.75 32.77,5.08 v32.77,2.54
N$12  (via drill 0.33)
  Top 0.254: LED17.1 28.31,1.52 v28.19,1.52 | v47.5,1.52 46.69,2.33 LED13.3
  Bottom 0.254: R26.1 28.19,4.24 v28.19,1.52 29.72,1.52 v47.5,1.52
N$13  (via drill 0.33)
  Top 0.254: LED15.1 71.19,27.62 v71.12,27.69
  Bottom 0.254: v71.12,27.69 67.54,27.69 R29.1
N$14  (via drill 0.33)
  Top 0.254: v16.76,30.73 15.72,30.73 LED10.3
  Bottom 0.254: R9.2 16.89,30.86 v16.76,30.73
N$15
  Bottom 0.254: R11.1 R12.2 C6.1 15.33,95.76 12.41,98.68 U1.5
N$16
  Bottom 0.254: NAV_NC.TP 2.79,87.98 SW1.NC
N$17  (via drill 0.33)
  Top 0.254: v16,110.49 15.24,109.73 v15.24,85.09
  Bottom 0.254: C4.1 v15.24,85.09 | v16,110.49 16.26,110.49 18.29,112.52 66.17,112.52 TOUCH_BRIGHTNESS.TP
N$18  (via drill 0.33)
  Top 0.254: v16,80.01 v16,109.47
  Bottom 0.254: C5.1 v16,80.01 | v16,109.47 14.99,110.49 11.05,110.49 TOUCH_PALETTE.TP
N$19
  Bottom 0.508: TP2.TP 75.44,20.32 77.72,22.61 77.72,38.86 76.45,40.13 76.45,55.12 71.12,60.45 71.12,80.03 C3.- 75.21,80.29 C3TH.-
N$20
  Bottom 0.254: R8.1 22.44,98.47 R13.2
N$21  (via drill 0.33)
  Top 0.254: v19.05,100.33 19.05,101.6 v19.56,102.11
  Bottom 0.254: R6.1 5.59,104.31 5.59,103.97 7.2,102.36 R7.2 C7.1 7.23,99.28 12.6,99.28 15.11,96.77 17.78,96.77 19.18,98.17 19.18,99.44 18.67,99.95 | U1.3 18.67,99.95 | v19.05,100.33 18.67,99.95 | v19.56,102.11 19.56,102.62 20.66,103.72 R3.2
N$31
  Bottom 0.254: R4.2 20.66,106.6 18.96,104.9 R3.1 18.96,103.38 18.07,102.49 U1.1
P00  (via drill 0.33)
  Top 0.254: RIGHT.P$2 v28.45,27.43 | v49.15,83.44 49.15,82.3 v49.91,81.53 | v37.08,62.74 v41.15,58.67
  Bottom 0.254: v28.45,27.43 27.43,28.45 27.43,44.07 38.23,54.86 TP_R.TP 39.75,57.28 v41.15,58.67 | v49.91,81.53 50.16,81.28 50.16,76.58 39.88,66.29 U2.6 37.47,66.29 37.08,65.91 v37.08,62.74 | J2.10 49.4,91.62 49.4,83.69 v49.15,83.44
P01  (via drill 0.33)
  Top 0.254: LEFT.P$1 v1.02,27.43 | v34.8,64.01 v30.73,64.01
  Bottom 0.254: v1.02,27.43 1.02,28.19 27.69,54.86 TP_L.TP 28.32,61.59 v30.73,64.01 49.84,83.11 49.84,88.43 49.93,88.52 J2.9 | U2.7 37.34,67.56 34.8,65.02 v34.8,64.01
P02  (via drill 0.33)
  Top 0.254: UP.P$2 14.73,40.64 v16,41.91
  Bottom 0.254: v16,41.91 27.43,53.34 29.97,53.34 31.5,54.86 TP_U.TP 32.13,64.77 50.27,82.91 50.27,88.25 50.43,88.41 J2.8
P03  (via drill 0.33)
  Top 0.254: DOWN.P$1 v14.73,13.72
  Bottom 0.254: v14.73,13.72 26.67,25.65 26.67,44.32 35.94,53.59 TP_D.TP 44.83,63.75 45.72,63.75 48.26,63.75 50.7,66.2 50.7,88.07 50.93,88.3 J2.7
P10  (via drill 0.33)
  Top 0.254: A.P$1 v73.15,36.83 | v50.78,65.02 v53.09,65.02
  Bottom 0.254: v73.15,36.83 73.03,36.83 TP_A.TP 54.99,63.12 v53.09,65.02 | OSD_A_PAD.TP 69.22,101.73 65.53,98.04 61.91,98.04 61.4,97.54 53.21,97.54 51.43,95.75 J2.6 51.43,88.19 51.13,87.89 51.13,65.38 v50.78,65.02
P11  (via drill 0.33)
  Top 0.254: B.P$2 v58.67,29.97 | v50.8,63.5 v50.8,56.9 | v62.23,97.18 v62.23,98.7
  Bottom 0.254: v58.67,29.97 51.18,37.47 TP_B.TP 51.18,56.52 v50.8,56.9 | v50.8,63.5 51.57,64.27 51.57,87.71 51.93,88.08 J2.5 51.93,95.62 53.34,97.03 62.08,97.03 v62.23,97.18 | OSD_B_PAD.TP 65.41,101.62 62.48,98.7 v62.23,98.7
P12  (via drill 0.33)
  Top 0.254: SELECT.P$2 33.58,6.86 v34.8,6.86 | v38.35,63.75 v42.67,59.44
  Bottom 0.254: v34.8,6.86 34.8,46.1 TP_SEL.TP | U2.5 38.35,64.93 38.35,64.88 v38.35,63.75 | v42.67,59.44 43.56,58.55 TP_SEL.TP | TP_SEL.TP 52,63.3 52,87.53 52.43,87.97 J2.4 52.43,95.36 53.59,96.52 62.5,96.52 63.59,97.61 68.91,97.61 73.03,101.73 OSD_SEL_PAD.TP
P13  (via drill 0.33)
  Top 0.254: START.P$2 48.84,6.86 v50.04,6.86
  Bottom 0.254: v50.04,6.86 47.37,9.52 SP_ST.TP 52.43,59.92 52.43,87.35 52.93,87.85 J2.3
PSU_EN
  Bottom 0.254: R4.1 18.88,107.1 Q1.1
PUSH  (via drill 0.33)
  Top 0.254: v45.97,81.28 45.97,67.94 v46.35,67.56
  Bottom 0.254: SW1.T 12.21,82.57 R10.1 12.23,81.88 12.83,81.28 14.22,81.28 15.49,82.55 17.53,82.55 | v46.35,67.56 46.37,67.57 U2.2 | v45.97,81.28 43.69,81.28 42.42,82.55 17.53,82.55 | PUSH.TP 17.53,82.55
ROCK_DOWN
  Bottom 0.254: SW1.2 12.17,80.07 C5.2
ROCK_UP
  Bottom 0.254: SW1.1 12.21,85.07 C4.2
SPK+
  Bottom 0.254: J2.2 53.43,92.93 54.48,93.98
  Bottom 0.508: 54.48,93.98 60.68,93.98 C3.+ 77.24,83.29 C3TH.+
SPK-
  Bottom 0.254: J2.1 53.93,92.54 54.61,93.22
  Bottom 0.508: TP1.TP 72.14,18.03 76.96,22.86 76.96,38.35 75.69,39.62 75.69,54.86 70.36,60.2 70.36,77.98 69.6,78.74 69.6,83.9 60.27,93.22 54.61,93.22
SPL
  Bottom 0.254: J1.13 J2.38
SPS
  Bottom 0.254: J2.45 J1.6
(copper drawn outside any net)
  shapes: Top circle x1

### Text on the board
tPlace: A | A | A | A | A | A | A | A
bPlace: LMV358 | SPEAKER
tNames: +
bNames: PALETTE | BRIGHTNESS | TO OSD BOARD | --OSD INPUTS-- | BATT | B | A | SEL | TO CPU BOARD | + | SELECT | RIGHT | START | DOWN | LEFT | UP | B | A | NOW YOU'RE PLAYING WITH | PORTABLE POWER!
tStop: SUPPORT ORIGINAL CREATORS!
bStop: v1.3 | DMGC-IPS-01